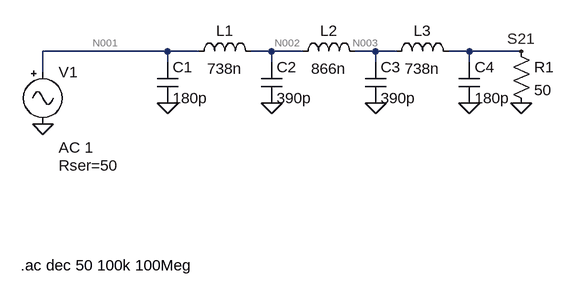
[diagram p0: schematic Output LP Filter.asc]
Output LP Filter.asc, the LTspice schematic file:
Version 4
SHEET 1 880 680
WIRE -112 176 -304 176
WIRE -64 176 -112 176
WIRE 48 176 16 176
WIRE 96 176 48 176
WIRE 208 176 176 176
WIRE 240 176 208 176
WIRE 352 176 320 176
WIRE 432 176 352 176
WIRE -112 192 -112 176
WIRE 48 192 48 176
WIRE 208 192 208 176
WIRE 352 192 352 176
WIRE -304 208 -304 176
FLAG -112 256 0
FLAG 48 256 0
FLAG 208 256 0
FLAG 352 256 0
FLAG 432 256 0
FLAG -304 288 0
FLAG 432 176 S21
SYMBOL ind -80 192 R270
WINDOW 0 32 56 VTop 0
WINDOW 3 5 56 VBottom 0
SYMATTR InstName L1
SYMATTR Value 738n
SYMBOL ind 80 192 R270
WINDOW 0 32 56 VTop 0
WINDOW 3 5 56 VBottom 0
SYMATTR InstName L2
SYMATTR Value 866n
SYMBOL ind 224 192 R270
WINDOW 0 32 56 VTop 0
WINDOW 3 5 56 VBottom 0
SYMATTR InstName L3
SYMATTR Value 738n
SYMBOL cap -128 192 R0
SYMATTR InstName C1
SYMATTR Value 180p
SYMBOL cap 32 192 R0
SYMATTR InstName C2
SYMATTR Value 390p
SYMBOL cap 192 192 R0
SYMATTR InstName C3
SYMATTR Value 390p
SYMBOL cap 336 192 R0
SYMATTR InstName C4
SYMATTR Value 180p
SYMBOL res 416 160 R0
SYMATTR InstName R1
SYMATTR Value 50
SYMBOL Misc\\signal -304 192 R0
WINDOW 123 24 132 Left 0
WINDOW 39 24 160 Left 0
SYMATTR InstName V1
SYMATTR Value ""
SYMATTR Value2 AC 1
SYMATTR SpiceLine Rser=50
TEXT -338 506 Left 0 !.ac dec 50 100k 100Meg

The netlist it stands for:
* Output LP Filter.asc
L1 N001 N002 738n
L2 N002 N003 866n
L3 N003 S21 738n
C1 N001 0 180p
C2 N002 0 390p
C3 N003 0 390p
C4 S21 0 180p
R1 S21 0 50
V1 N001 0 AC 1 Rser=50
.ac dec 50 100k 100Meg
.backanno
.end

* Results of the author's LTspice run, read from the files saved beside the schematic
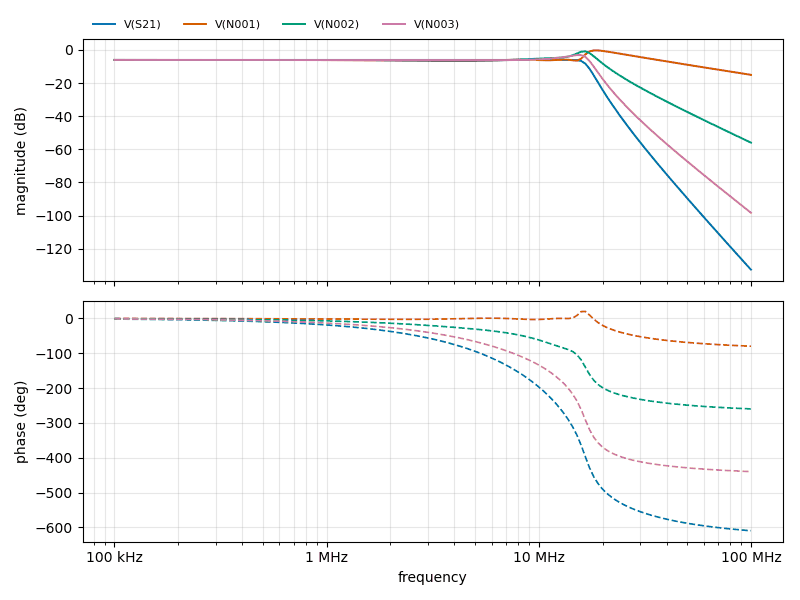
[diagram p1: AC Analysis of Output LP Filter.asc, plotted from the saved traces]
* AC Analysis, 1 run:
*   V(S21): -6.02 dB at 100 kHz, -132.71 dB at 100 MHz, peak -6.02 dB at 100 kHz, 3 dB below the peak at 16.77 MHz
*   V(N001): -6.02 dB at 100 kHz, -15.02 dB at 100 MHz, peak -0.26 dB at 18.2 MHz, 3 dB below the peak at 16.4 MHz and 26.96 MHz
*   V(N002): -6.02 dB at 100 kHz, -55.99 dB at 100 MHz, peak -0.85 dB at 16.6 MHz, 3 dB below the peak at 13.91 MHz and 18.18 MHz
*   V(N003): -6.02 dB at 100 kHz, -98.34 dB at 100 MHz, peak -3.09 dB at 15.14 MHz, 3 dB below the peak at 7.568 MHz and 17.16 MHz